# Altium schematic sheet ControlPower.SchDoc
size A4
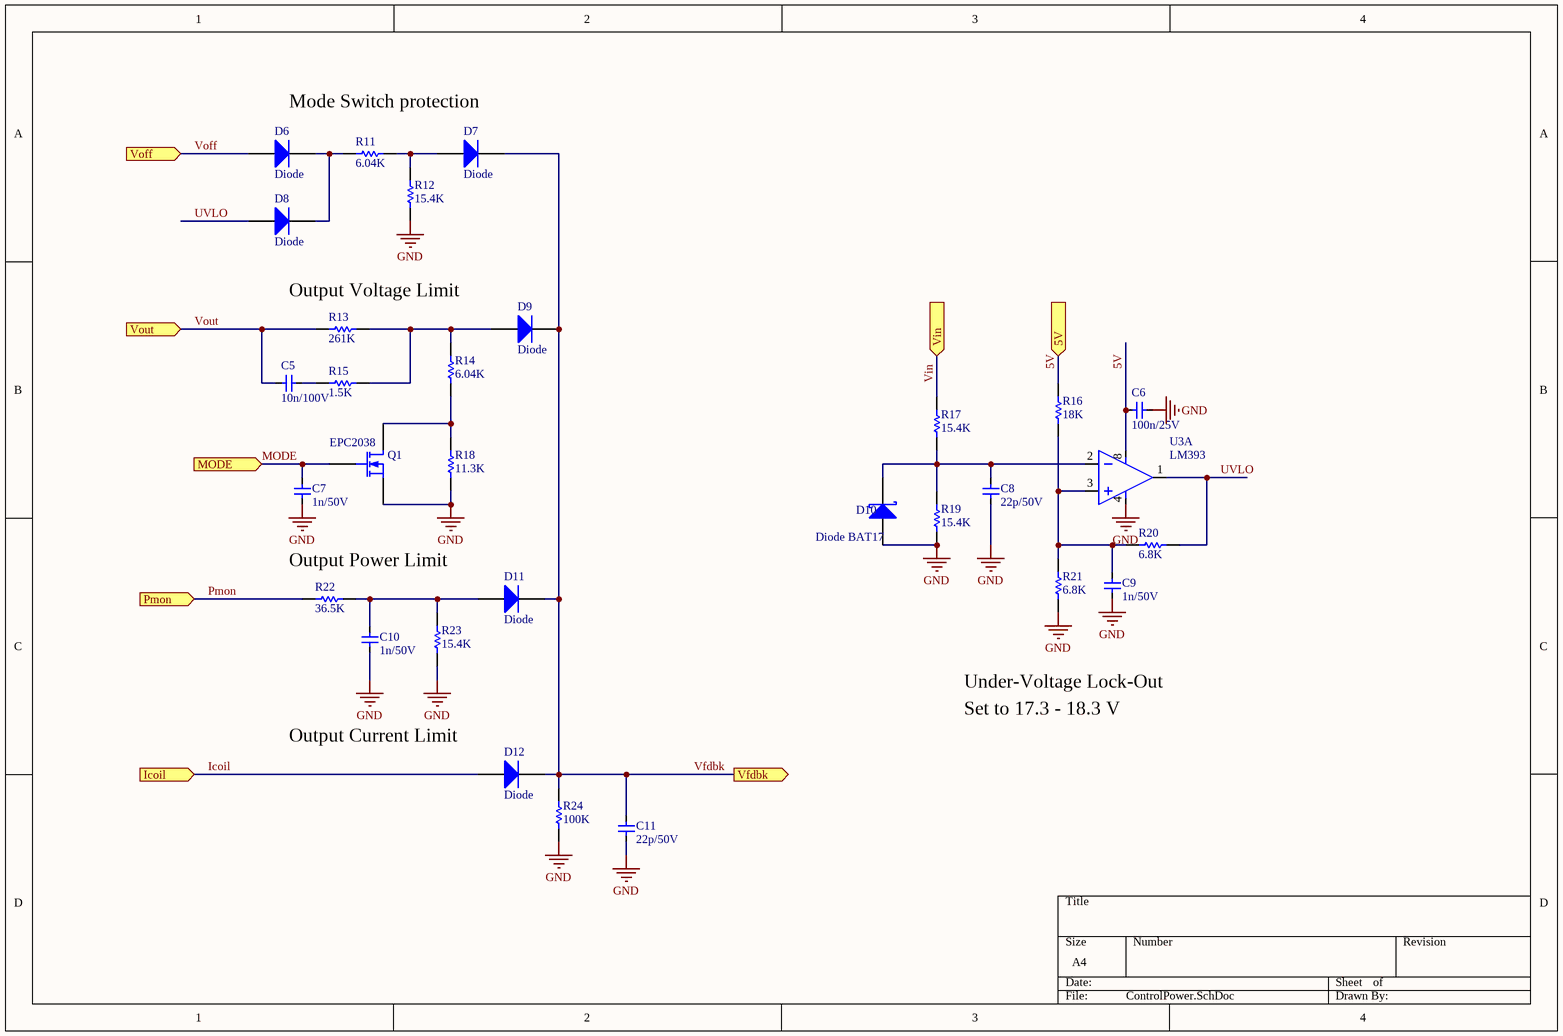
[diagram p0: ControlPower.SchDoc]

## Parts
C5  10n/100V  [0603]
C6  100n/25V  [0603]
C7  1n/50V  [0603]
C8  22p/50V  [0603]
C9  1n/50V  [0603]
C10  1n/50V  [0603]
C11  22p/50V  [0603]
D6  Diode  [SMA]
D7  Diode  [SMA]
D8  Diode  [SMA]
D9  Diode  [SMA]
D10  Diode BAT17  [SMA]
D11  Diode  [SMA]
D12  Diode  [SMA]
Q1  EPC2038  [BGA100P9X9-81A]
R11  value 6.04K  [0603]  (hidden comment: Res1)
R12  value 15.4K  [0603]  (hidden comment: Res1)
R13  value 261K  [0603]  (hidden comment: Res1)
R14  value 6.04K  [0603]  (hidden comment: Res1)
R15  value 1.5K  [0603]  (hidden comment: Res1)
R16  value 18K  [0603]  (hidden comment: Res1)
R17  value 15.4K  [0603]  (hidden comment: Res1)
R18  value 11.3K  [0603]  (hidden comment: Res1)
R19  value 15.4K  [0603]  (hidden comment: Res1)
R20  value 6.8K  [0603]  (hidden comment: Res1)
R21  value 6.8K  [0603]  (hidden comment: Res1)
R22  value 36.5K  [0603]  (hidden comment: Res1)
R23  value 15.4K  [0603]  (hidden comment: Res1)
R24  value 100K  [0603]  (hidden comment: Res1)
U3  LM393  [SO8_L]  (part A of 2)

## Ports
5V (in), Icoil (in), MODE (in), Pmon (in), Vfdbk (out), Vin (in), Voff (in), Vout (in)

## Nets
GND: C6.2 C7.1 C8.1 C9.1 C10.1 C11.1 D10.1(A) Q1.3(S) R12.2 R18.2 R19.2 R21.2 R23.2 R24.2 U3.4(vcc)
5V: C6.1 R16.1 U3.8(gnd) ; port 5V
Icoil: D12.1(A) ; port Icoil
MODE: C7.2 Q1.2(G) ; port MODE
Pmon: R22.1 ; port Pmon
UVLO: D8.1(A) R20.2 U3.1
Vfdbk: C11.2 D7.2(K) D9.2(K) D11.2(K) D12.2(K) R24.1 ; port Vfdbk
Vin: R17.1 ; port Vin
Voff: D6.1(A) ; port Voff
Vout: C5.1 R13.2 ; port Vout
NetC5_2: C5.2 R15.2
NetC8_2: C8.2 D10.3(K) R17.2 R19.1 U3.2
NetC9_2: C9.2 R16.2 R20.1 R21.1 U3.3
NetC10_2: C10.2 D11.1(A) R22.2 R23.1
NetD6_2: D6.2(K) D8.2(K) R11.2
NetD7_1: D7.1(A) R11.1 R12.1
NetD9_1: D9.1(A) R13.1 R14.1 R15.1
NetQ1_1: Q1.1(D) R14.2 R18.1

## Notes on the sheet
- Mode Switch protection
- Output Voltage Limit
- (near R22) Output Power Limit
- Under-Voltage Lock-Out
- Set to 17.3 - 18.3 V
- (near D12) Output Current Limit

## Library data of the parts
C5-C11 = CAP1: Capacitor
D6-D9 D11 D12 = Diode: Default Diode; Published: 8-Jun-2000; LatestRevisionDate: 17-Jul-2002; LatestRevisionNote: Re-released for DXP Platform.; PackageVersion: Sep-1996; PackageReference: SMC; Publisher: Altium Limited; PackageDescription: DO-214-AB/SMC; 2 C-Bend Leads; Body 7.9 x 5.9 mm, inc. leads (LxW); Code_JEDEC: DO-214-AB
D10 = Diode BAT17: Silicon RF Schottky Diode for Mixer Applications in the VHF/UHF Range; pin to pad: 3>2; Note: Pin 2 is not connected and not drawn.; Published: 21-Mar-2003; LatestRevisionDate: 29-May-2009; LatestRevisionNote: IPC-7351 Footprint Added.; DatasheetVersion: Oct-1999; PackageVersion: Sep-2001; PackageReference: SOT-23; Publisher: Altium Limited; PackageDescription: 3-Pin SOT-23 Package 0.95 mm Pitch, 2.5 mm Lead Span; ComponentLink1Description: Manufacturer Link; ComponentLink1URL: http://www.infineon.com/; ComponentLink2Description: Datasheet; ComponentLink2URL: http://www.infineon.com/upload/Document/cmc_upload/documents/009/363/bat17series.pdf
Q1 = MOSFET-N: N-Channel MOSFET; Published: 8-Jun-2000; LatestRevisionDate: 17-Jul-2002; LatestRevisionNote: Re-released for DXP Platform.; PackageVersion: 1995/1996; PackageReference: E3; Publisher: Altium Limited; PackageDescription: TO, Flat Index; 3 In-Line, Axial Leads; Body Dia. 4.6mm; Lead Dia. 0.5 mm (max)
R11-R24 = Res1: Resistor; Published: 8-Jun-2000; LatestRevisionDate: 17-Jul-2002; LatestRevisionNote: Re-released for DXP Platform.; PackageReference: AXIAL-0.3; Publisher: Altium Limited; PackageDescription: Axial Device, Thru-Hole; 2 Leads; 0.3 in Pin Spacing